# Altium schematic sheet Schmatic.SchDoc
size A4; SheetNumber: 1; SheetTotal: 1
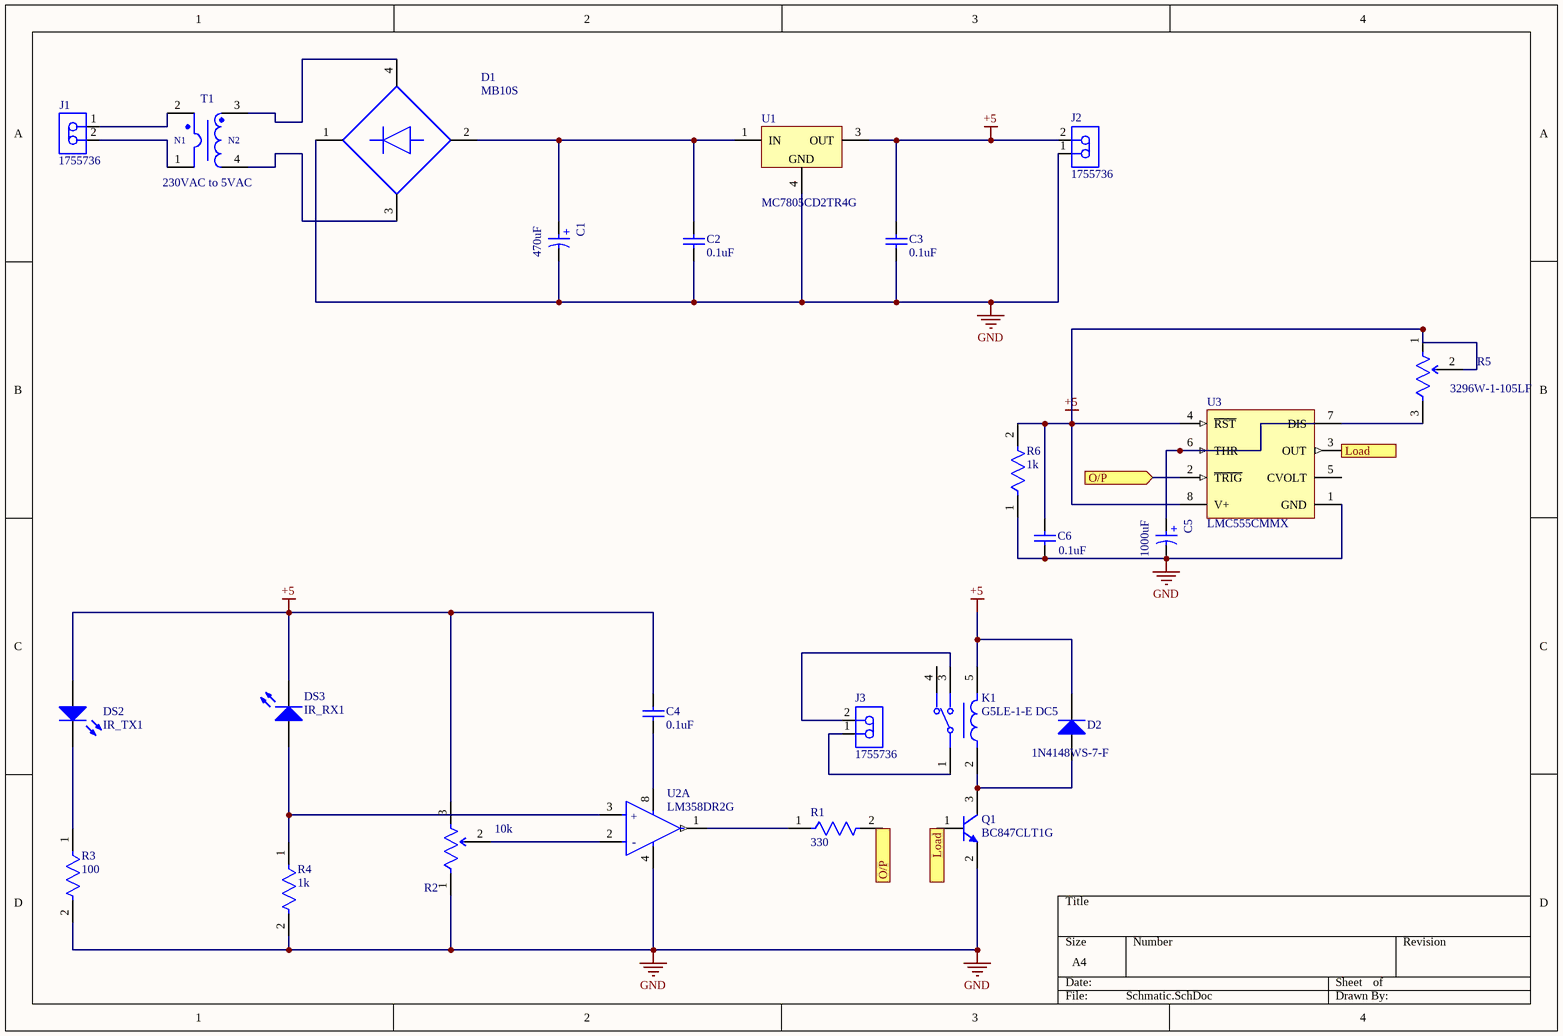
[diagram p0: Schmatic.SchDoc]

## Parts
C1  470uF  [WCAP-ATLI_D13H25]
C2  0.1uF  [CAPC2013X145X50NL20T25]
C3  0.1uF  [CAPC2013X145X50NL20T25]
C4  0.1uF  [CAPC2013X145X50NL20T25]
C5  1000uF  [WCAP-ATLI_D13H25]
C6  0.1uF  [CAPC2013X145X50NL20T25]
D1  MB10S  [FP-751EP-MFG]
D2  1N4148WS-7-F  [DIOD-SOD323-2-A_V]
DS2  IR_TX1  [VISH-TSAL6200]
DS3  IR_RX1  [VISH-TSAL6200]
J1  1755736  [PHOE-1755736-2_V]
J2  1755736  [PHOE-1755736-2_V]
J3  1755736  [PHOE-1755736-2_V]
K1  G5LE-1-E DC5  [FP-G5LE-1-E_DC5-MFG]
Q1  BC847CLT1G  [ONSC-SOT-23-3-318-08_V]
R1  330  [FP-AC1206-MFG]
R2  10k  [FP-3296W-MFG]
R3  100  [FP-AC1206-MFG]
R4  1k  [FP-AC1206-MFG]
R5  3296W-1-105LF  [FP-3296W-MFG]
R6  1k  [FP-AC1206-MFG]
T1  230VAC to 5VAC  [WE-CSTLF_EI187]
U1  MC7805CD2TR4G  [ONSC-D2PAK-3-936-03_V]
U2  LM358DR2G  [FP-751-07-IPC_C]  (part A of 2)
U3  LMC555CMMX  [DGK0008A_L]

## Ports
Load (in, see Schmatic[4B]), Load (out, see Schmatic[3D]), O/P (in, see Schmatic[3D]), O/P (out, see Schmatic[3B])

## Nets
+5: C3.1 C4.1 C6.1 D2.2(K) DS2.1(A) DS3.2(K) J2.2 K1.5 R2.3(CW) R5.1(CCW) R5.2(WIPER) R6.2 U1.3(OUT) U3.4(~{RST}) U3.8(V+)
GND: C1.2(N) C2.2 C3.2 C5.2(N) C6.2 D1.1(+) J2.1 Q1.2(E) R2.1(CCW) R3.2 R4.2 R6.1 U1.4(GND) U2.4(VEE/GND) U3.1(GND)
Load: Q1.1(B) U3.3(OUT) ; port Load
O/P: R1.2 U3.2(~{TRIG}) ; port O/P
NetC1_1: C1.1(P) C2.1 D1.2(-) U1.1(IN)
NetC4_2: C4.2 U2.8(VCC)
NetC5_1: C5.1(P) U3.6(THR)
NetD1_3: D1.3(1_~) T1.4
NetD1_4: D1.4(2_~) T1.3
NetD2_1: D2.1(A) K1.2 Q1.3(C)
NetDS2_2: DS2.2(K) R3.1
NetDS3_1: DS3.1(A) R4.1 U2.3(INPUT_A+)
NetJ1_1: J1.1 T1.2
NetJ1_2: J1.2 T1.1
NetJ3_1: J3.1 K1.1
NetJ3_2: J3.2 K1.3
NetR1_1: R1.1 U2.1(OUTPUT_A)
NetR2_2: R2.2(WIPER) U2.2(INPUT_A-)
NetR5_3: R5.3(CW) U3.7(DIS)

Not connected (* = marked no-connect by the designer): K1 4; U3 5(CVOLT)

## Notes on the sheet
- (in symbol CMP-1310-00291-2, part A) +; -
- (in symbol CMP-03913-54218056-2) +
- (in symbol CMP-03913-148624225-1) N1; N2

## Library data of the parts
C1 C5 = CMP-03913-54218056-2: Cap, 2700Uf, 16V, Alu Elec, Radial Rohs Compliant: Yes; Life (Hours): 5000hours; Pitch: 5mm; Capacitance: 2.7mF; Leakage Current: 432µA; Tolerance: 20%; Polarity: Polar; Impedance: 22mΩ; Ripple Current: 3A; Mount: Through Hole; Voltage Rating: 16V; Max Operating Temperature: 105°C; Min Operating Temperature: -55°C; Case/Package: Radial; Length: 25mm; Diameter: 13mm; Height - Seated (Max): 26.4922mm; Packaging: Tape & Box (TB); Lead Pitch: 5.0038mm; RoHS: Compliant
C2-C4 C6 = CMP-2007-01227-1: Manufacturer: Kemet; Part Number: C0805S104K5RACTU
D1 = CMP-07163-000045-1: BRIDGE RECT 1P 1KV 500MA 4SOIC; Capacitance: 470pF; Forward Current: 800mA; Element Configuration: Single; Number of Elements: 1; Max Forward Surge Current (Ifsm): 35A; Lead/Base Style: Formed Leads; Forward Voltage: 1V; Tolerance: 10%; Voltage Rating: 500V; Max Power Dissipation: 1.4W; Peak Reverse Current: 5uA; Case/Package: SOIC; Min Operating Temperature: -55°C; Package Quantity: 500; Height: 2.7mm; Mount: Surface Mount; Average Rectified Current: 500mA; Radiation Hardening: No; Width: 4.2mm; Peak Non-Repetitive Surge Current: 35A; REACH SVHC: No SVHC; Max Repetitive Reverse Voltage (Vrrm): 1kV; Weight: 0.228g; Length: 4.95mm; Height - Seated (Max): 0.354inch; Case Code (Imperial): 1206; Thickness: 0.039inch; Packaging: Tape and Reel; Lead Free: Lead Free; Case Code (Metric): 3216; Contact Plating: Tin; Reverse Voltage (DC): 1kV; Number of Pins: 4; Max Operating Temperature: 150°C; Lead Pitch: 0.197inch; Max Surge Current: 35A
D2 = CMP-1667-00004-1: Fast Switching Diode, 75 V, 0.3 A, -65 to 150 degC, 2-Pin SOD323, RoHS, Tape and Reel; DatasheetVersion: Rev. 25-2, 03/2016; PackageDescription: 2-Pin Small Outline Diode, Body 1.7 x 1.3 mm; ComponentLink2Description: Datasheet; ComponentLink1URL: http://www.diodes.com/; PackageReference: SOD323-2; ComponentLink2URL: http://www.diodes.com/datasheets/ds30097.pdf; ComponentLink1Description: Manufacturer URL
DS2 DS3 = CMP-2000-07327-1: High Power Infrared Emitting Diode, GaAlAs, MQW, 1.35 V, 100 mA, -40 to 85 degC, 2-Pin THD, RoHS, Bulk; Manufacturer: Vishay; Lum Intensity: 500mW/srmcd; Product Depth (mm): 5.8mm; Type: IrLED; Luminous Intensity: 500mW/sr; Forward Voltage: 3V; Shape Type: Circular; Peak Wavelength: 950nm; Rad Hardened: No; Product Height (mm): 8.7mm; Number of  Elements: 1; Forward Current: 100mA; High Brightness: Yes; Reverse Voltage: 5V; DELETED: Compliant; Power Dissipation: 160W; Viewing Angle: 34deg; Lens Type: Colored; Packaging: Bulk; Lens Dimensions: 5x5x7.7mm; Package Reference: TSAL6200; Chip Material: GaAlAs; Package Description: 2-Pin Through Hole Device, Dia 5.8 mm, Pitch 2.54 mm; Main Category: IrLED; Manufacturer URL: http://www.vishay.com/; Product Length (mm): 5.8mm; Datasheet URL: http://www.vishay.com/docs/81010/tsal6200.pdf; Operating Temperature Classification: Industrial; Package Type: T-13/4; Pin Count: 2; Mounting: ThroughHole; Mounting Technology: ThroughHole; Test Current (It): 100mA; Datasheet Version: Rev. 2.4, 03/2014; Operating Temp Range: -40Cto85C
J1-J3 = CMP-2000-05300-1: Male Header, Pitch 5.08 mm, 1 x 2 Postion, Height 12 mm, Tail Length 3.9 mm, RoHS, Bulk; Manufacturer: Phoenix Contact; Content: 250pc(s); Pitch: 5.08mm; Industrial packaging: Yes; Number of contacts: 2; Manufacturer URL: http://www.phoenixcontact.com/; Datasheet Version: Apr-16; Datasheet URL: http://www.mouser.com/ds/2/324/ItemDetail_1755736-921028.pdf; Manufacturer part No.: 1755736; Type: MSTBVA2,5/2-G-5,08; Colour: Green
K1 = CMP-08822-000286-1: RELAY GEN PURPOSE SPDT 16A 5V; Power Consumption: 400mW; Coil Resistance: 63R; Coil Type: Non-Latching; Release Time: 5ms; Max Voltage Rating (AC): 250V; Relay Type: General Purpose; Life (Hours): 1000000Hour; Coil Current: 79.4mA; Operate Time: 10ms; Packaging: Rail/Tube; Lead Free: Lead Free; Throw Configuration: SPDT; Termination: Solder; Height: 19mm; Series: G5LE; RoHS Compliant: Yes; Min Operating Temperature: -25°C; Package Quantity: 100; Width: 16.5mm; Contact Material: Tin; Length: 22.5mm; Coil Power: 400mW; Coil Voltage (DC): 5V; Depth: 16.5mm; Radiation Hardening: No; Max Current Rating: 16A; Contact Current Rating: 16A; Weight: 12g; Max Operating Temperature: 85°C; Number of Pins: 5; Mount: PCB
Q1 = CMP-1048-00770-1: General Purpose Transistor, NPN Silicon, 3-Pin SOT-23, Pb-Free, Tape and Reel; Manufacturer: On Semiconductor; IC Continuous (A): 0.1; fT Min (MHz): 100; ComponentLink1URL: http://www.onsemi.com/; ComponentLink3URL: http://www.onsemi.cn/pub_link/Collateral/318-08.PDF; PackageVersion: Rev. AP, 11/2009; RoHS: TRUE; Mounting Technology: Surface Mount; PackageDescription: 3-Pin Small Outline Transistor, Body 2.92 x 1.3 mm, Pitch 0.95 mm; Packing: Tape and Reel; DatasheetVersion: Rev. 11; ComponentLink1Description: Manufacturer URL; ComponentLink2Description: Datasheet; ComponentLink3Description: Package Specification; PackageReference: SOT-23-3-318-08; PartNumber: BC847CLT1G; ComponentLink2URL: http://www.onsemi.cn/pub_link/Collateral/BC846ALT1-D.PDF; Polarity: NPN
R1 R3 R4 = CMP-03412-006130-1: RES SMD 6.2K OHM 5% 1/4W 1206; Manufacturer: Yageo; Manufacturer Part Number: AC1206JR-076K2L; Resistance: 6.2KΩ; Tolerance: 0.05; Voltage Rating: 200V; Automotive Grade: Grade 0; Value: 6.2KΩ; Power Rating: 0.25W; Temperature: -55°C to +155°C; Octopart: https://octopart.com/ac1206jr-076k2l-yageo-30511322; Footprint Url: http://www.yageo.com/exep/pages/download/literatures/PYu-R_Mount_10.pdf; Composition: Thick Film; Device Class L2: Resistors; Temperature Range High: +155°C; Series: AC; Mouser Description: Thick Film Resistors - SMD 1/4W 6.2K ohm 5% AEC-Q200; Device Class L1: Passive Components; Temperature Range Low: -55°C; Height: 0.65mm; Ipc Land Pattern Name: RESC310160X55; Device Class L3: Chip SMD Resistors; ComponentLink2Description: Datasheet; Category: Res; RoHS: TRUE; Automotive: Yes; ComponentLink2URL: http://www.yageo.com/NewPortal/yageodocoutput?fileName=/pdf/R-Chip/PYu-AC_51_RoHS_L_6.pdf; Lead Free: Yes; Package: AC1206; Digikey Description: RES SMD 6.2K OHM 5% 1/4W 1206
R2 = CMP-1747-00001-8: TRIMMER 10K OHM 0.5W PC PIN TOP; Number of Turns: 25; Tolerance: 10%; Resistance: 10kR; Max Power Dissipation: 500mW; Temperature Coefficient: 100ppm/°C; Insulation Resistance: 1GR; Min Operating Temperature: -55°C; Resistor Type: Cermet; Series: 3296; Color: Blue; Mount: Through Hole; Taper: Linear; Radiation Hardening: No; RoHS Compliant: Yes; Width: 9.53mm; Resistance Tolerance: 10%; Contact Plating: Tin; Military Standard: Not; Package Quantity: 50; Weight: 0.03oz; Lead Free: Lead Free; Power Rating: 500mW; Termination: Pin; Technology: CERMET; Max Operating Temperature: 125°C; Packaging: Rail/Tube; Length: 9.53mm; Depth: 4.83mm; Height: 11.55mm; Reach SVHC Compliant: Yes
R5 = CMP-07234-000060-1: TRIMMER 1M OHM 0.5W PC PIN TOP; Max Power Dissipation: 500mW; Temperature Coefficient: 100ppm/°C; Resistance Tolerance: 10%; Voltage Rating (DC): 300V; Number of Turns: 25; Resistance: 1MR; Lead Diameter: 0.5mm; Taper: Linear; Contact Plating: Tin; Min Operating Temperature: -55°C; Length: 9.53mm; Technology: CERMET; Packaging: Rail/Tube; Termination: Pin; Depth: 4.83mm; Weight: 0.03oz; Mount: Through Hole; Radiation Hardening: No; Max Operating Temperature: 125°C; Width: 9.53mm; RoHS Compliant: Yes; Voltage Rating: 300V; Power Rating: 500mW; Reach SVHC Compliant: Yes; Series: 3296; Tolerance: 10%; Type: Potentiometer; Lead Free: Lead Free; Resistor Type: Cermet; Military Standard: Not; Package Quantity: 50; Height: 0.395inch; Color: Blue
R6 = CMP-03412-028020-1: RES SMD 191 OHM 1% 1/4W 1206; Manufacturer: Yageo; Manufacturer Part Number: AC1206FR-07191RL; Value: 191Ω; Tolerance: 0.01; Voltage Rating: 200V; Automotive Grade: Grade 0; Power Rating: 0.25W; Footprint Url: http://www.yageo.com/exep/pages/download/literatures/PYu-R_Mount_10.pdf; Device Class L1: Passive Components; Lead Free: Yes; Temperature Range High: +155°C; RoHS: TRUE; Temperature: -55°C to +155°C; Digikey Description: RES SMD 191 OHM 1% 1/4W 1206; Composition: Thick Film; Automotive: Yes; Device Class L2: Resistors; Height: 0.65mm; Device Class L3: Chip SMD Resistors; Package: AC1206; Ipc Land Pattern Name: RESC310160X55; Octopart: https://octopart.com/ac1206fr-07191rl-yageo-71368005; Series: AC; Temperature Range Low: -55°C; ComponentLink2URL: http://www.yageo.com/NewPortal/yageodocoutput?fileName=/pdf/R-Chip/PYu-AC_51_RoHS_L_6.pdf; ComponentLink2Description: Datasheet; Resistance: 191Ω; Category: Res
T1 = CMP-03913-148624225-1: Current Sense Transformer, 6.4H, Th Rohs Compliant: Yes
U1 = CMP-1679-00001-4: Positive Voltage Regulator, 1 A, 5 V Output Voltage, 0 to 125 degC, 3-Pin D2PAK (936-03), Pb-Free, Tape and Reel; Manufacturer: ON Semiconductor; Length: 10.24 mm; RoHSCompliant: true; Package Quantity: 800; ComponentLink2URL: http://www.onsemi.com/pub_link/Collateral/MC7800-D.PDF; ComponentLink1Description: Manufacturer URL; Max Operating Temperature: 125 degC; ComponentLink3URL: http://www.onsemi.com/pub_link/Collateral/936-03.PDF; Min Operating Temperature: 0 degC; Mounting Technology: Surface Mount; Pins: 3; PackageDescription: 3-Pin Transistor Outline, Body 10.02 x 9.1945 mm, Pitch 2.54 mm; ComponentLink3Description: Package Specification; ComponentLink1URL: http://www.onsemi.com/; PackageReference: D2PAK-3-936-03; Height: 30.02 mm; REACH SVHC: No SVHC; DatasheetVersion: Rev. 27, 11/2014; Mount: Surface Mount; Packaging: Tape and Reel; ComponentLink2Description: Datasheet; PackageVersion: Rev. E, 09/2015
U2 = CMP-1310-00291-2: IC OPAMP GP 2 CIRCUIT 8SOIC; Gain Bandwidth Product: 1MHz; Number of Circuits: 2; Min Supply Voltage: 3V; Slew Rate: 0.6V/µs; Max Dual Supply Voltage: 16V; Common Mode Rejection Ratio: 65dB; Input Bias Current: 250nA; Min Dual Supply Voltage: 1.5V; Dual Supply Voltage: 9V; Operating Supply Current: 1.5mA; Output Current: 40mA; Input Offset Voltage (Vos): 7mV; Nominal Supply Current: 1.2mA; Voltage Gain: 100dB; Max Supply Voltage: 32V; Width: 4mm; Number of Pins: 8; Min Operating Temperature: 0°C; REACH SVHC: No SVHC; Contact Plating: Tin; Lead Free: Lead Free; Halogen Free: Halogen Free; Power Supply Rejection Ratio (PSRR): 65dB; Operating Supply Voltage: 16V; Package Quantity: 2500; Max Operating Temperature: 70°C; Case/Package: SOIC; Height: 1.5mm; Packaging: Tape and Reel; Radiation Hardening: No; Number of Channels: 2; Bandwidth: 1MHz; Length: 5mm; Number of Elements: 2; Number of Amplifiers: 2; Output Current per Channel: 40mA
U3 = CMP-0056-00149-3: CMOS Timer, 8-pin Mini SOIC; Manufacturer: Texas Instruments; CompType: Analog IC; PowerWise: N; PackageTopMarking: ZXTT*ZC5; PackageDescription: MINI SOIC, .118 x .118 x .034in, 8 Lead, .0256in Pitch; Code_JEDEC: MO-187-AA; PackageReference: DGK0008A; PinCount: 8; RoHS: N; ComponentLink1URL: http://www.ti.com/general/docs/lit/getliterature.tsp?genericPartNumber=LMC555&fileType=pdf; ComponentLink1Description: Datasheet URL